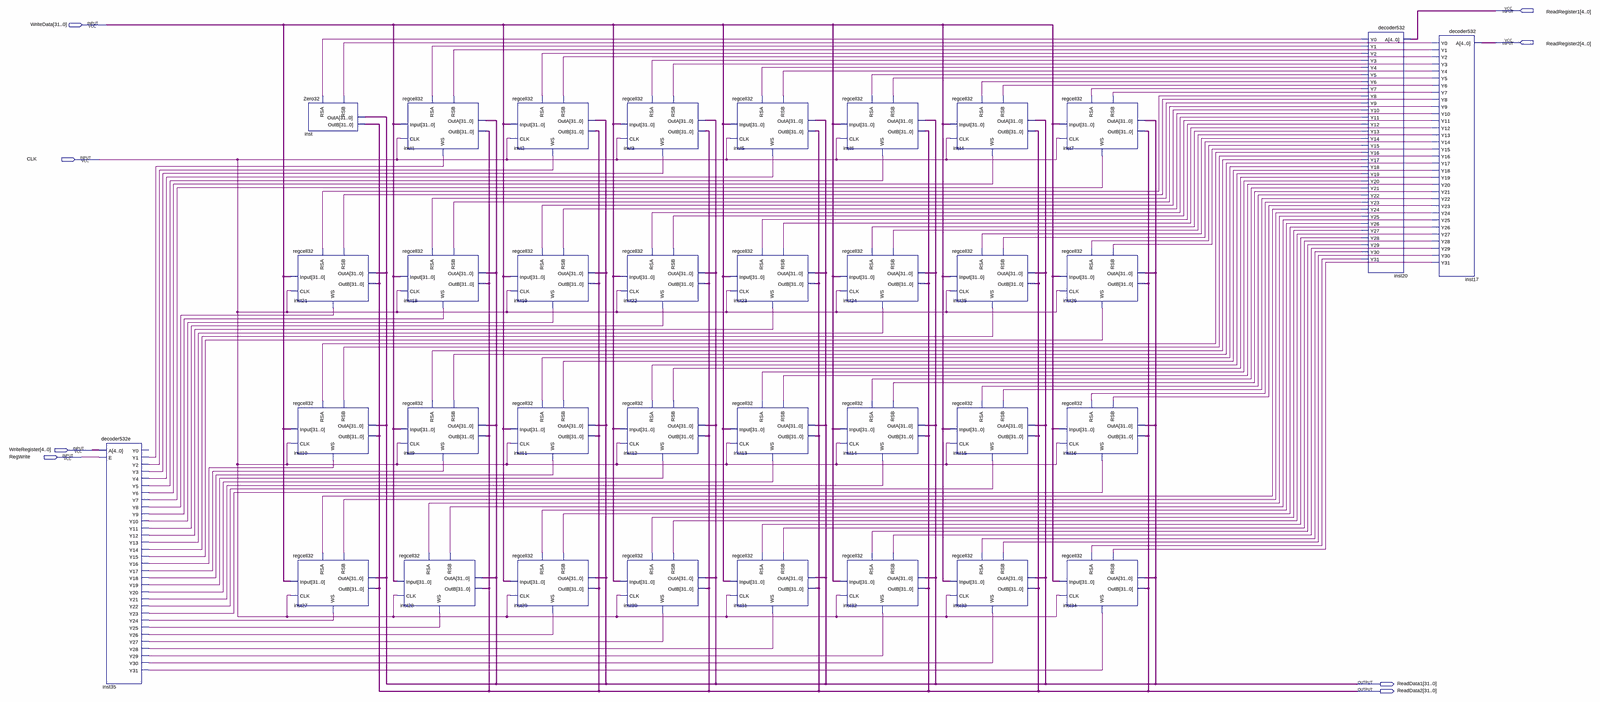
[diagram p0: schematic sheet, whole]
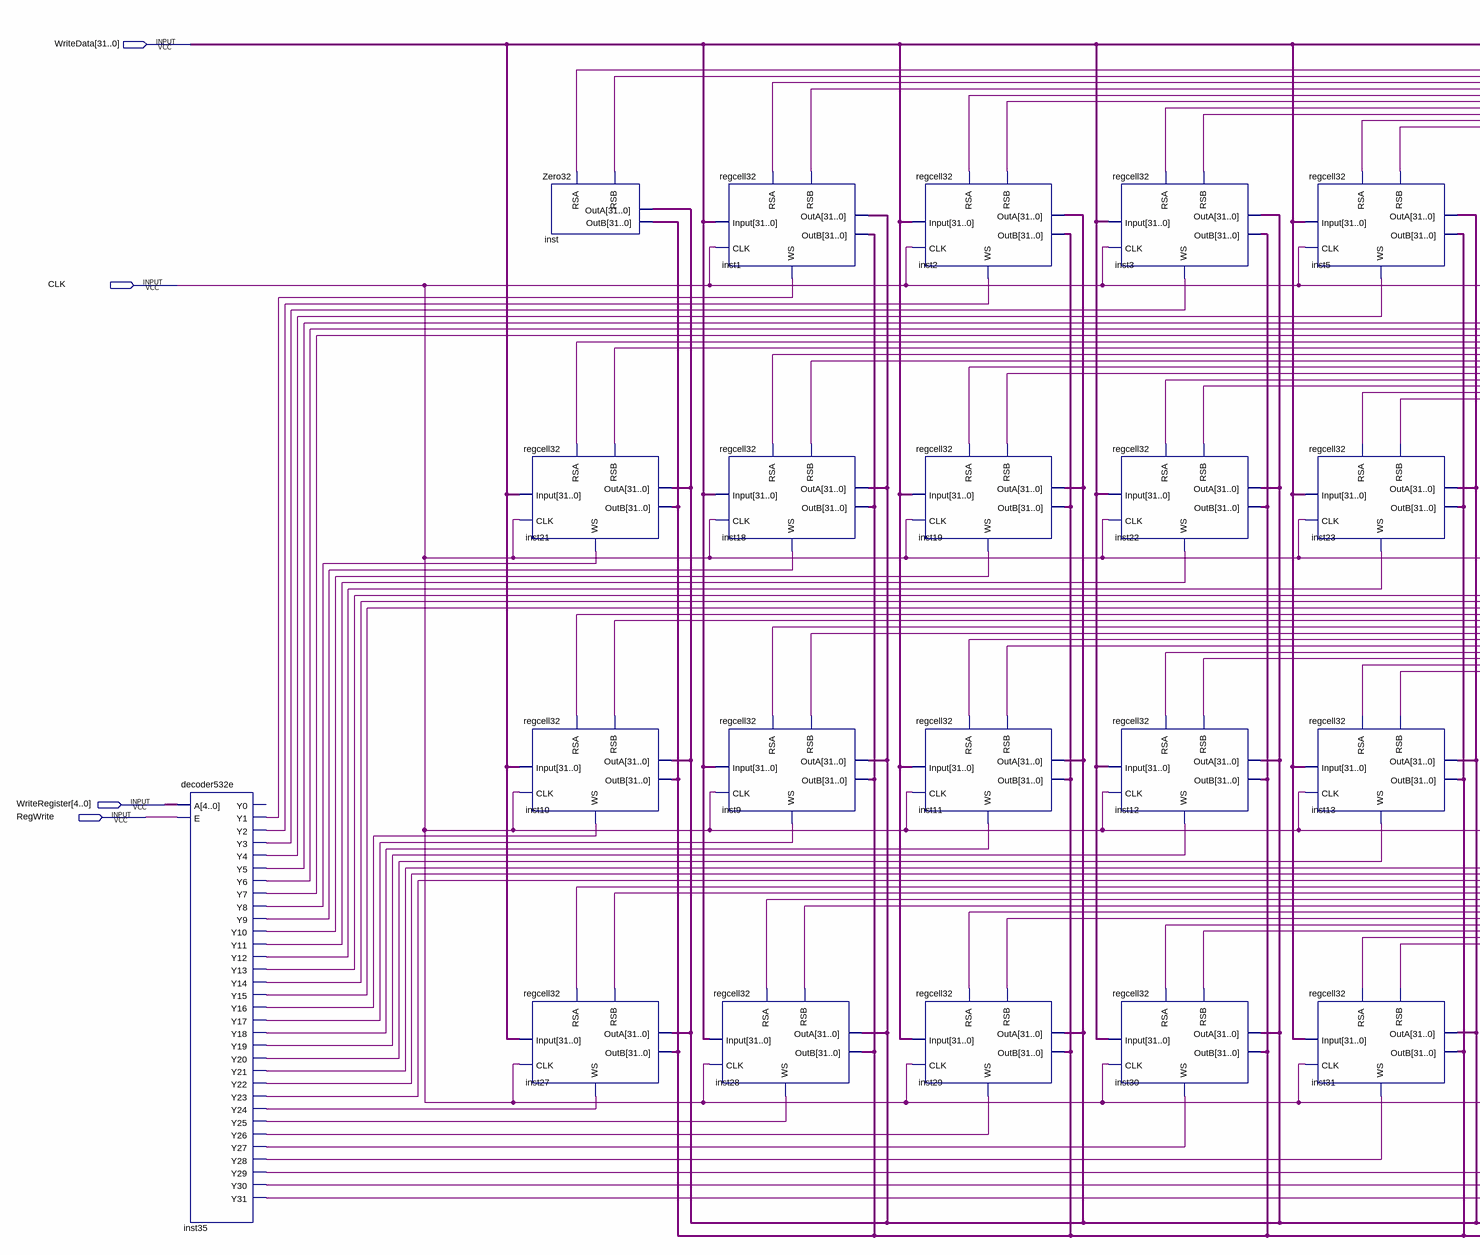
[diagram p1: schematic sheet, left part]
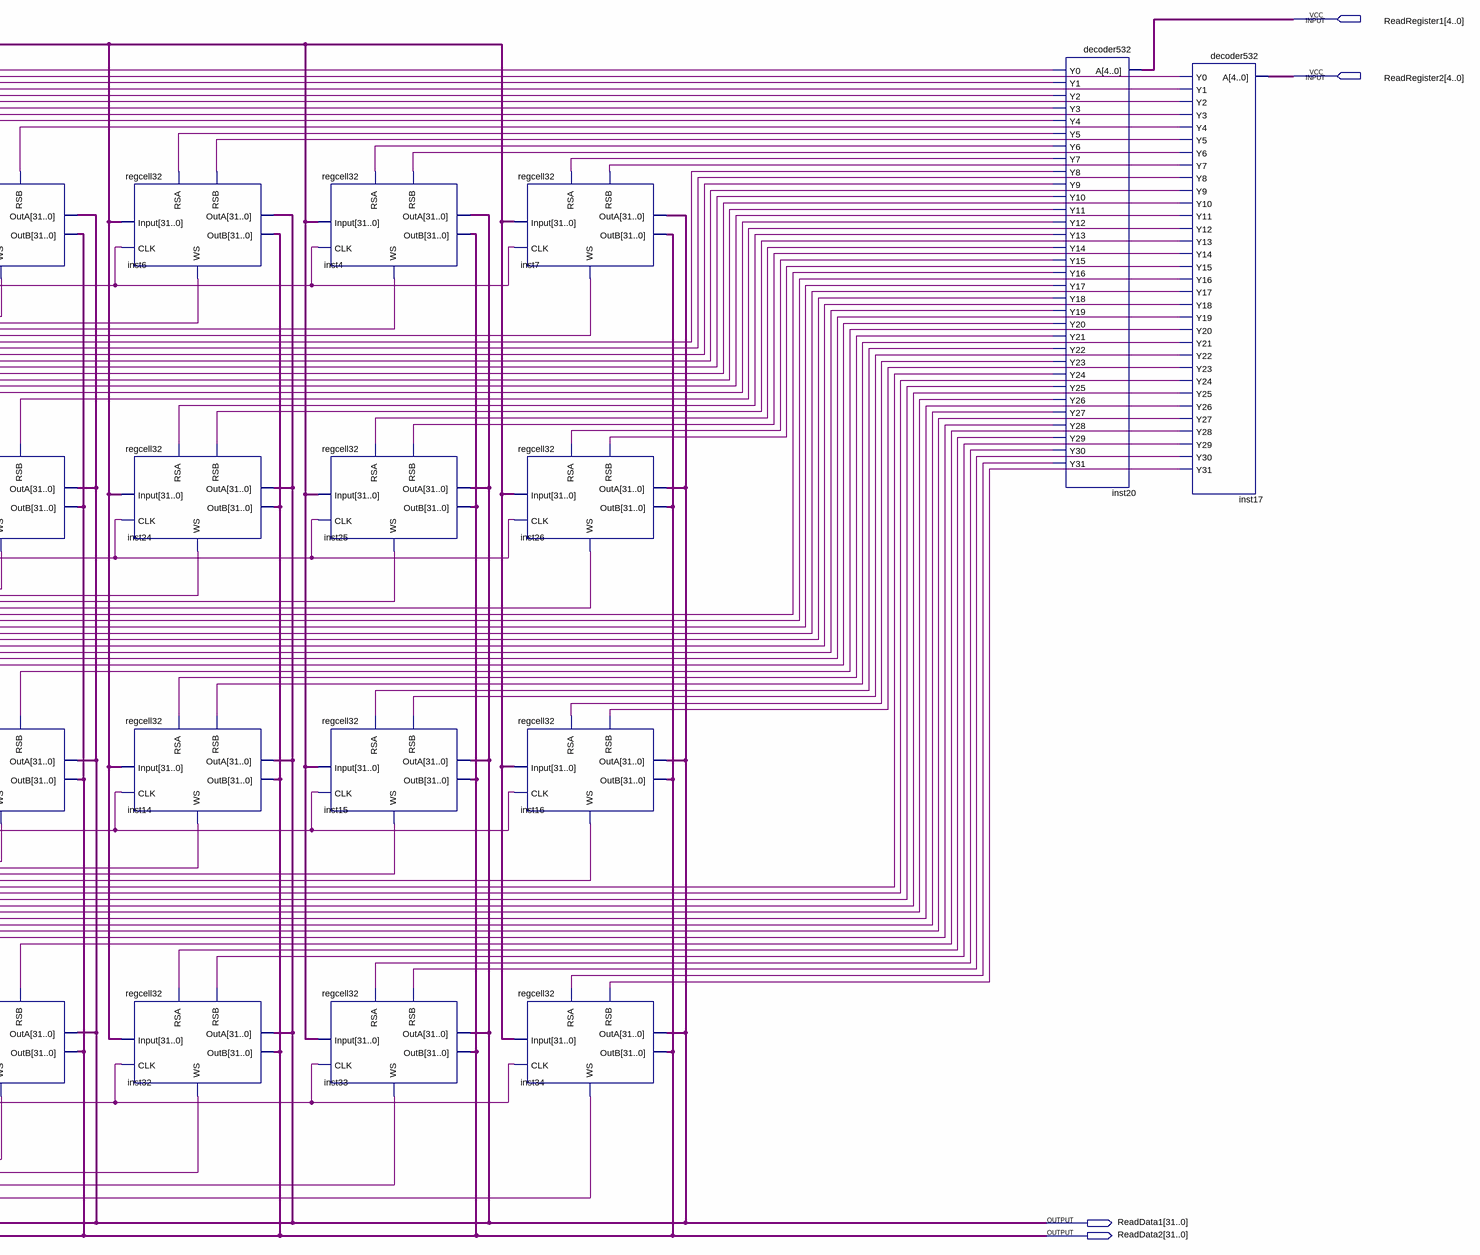
[diagram p2: schematic sheet, right part]
// Quartus schematic Registers.bdf as structural Verilog: 35 symbols, 8 pins
module Registers (
  input  [4:0] ReadRegister1,
  input  [31:0] WriteData,
  input  [4:0] ReadRegister2,
  input  CLK,
  input  [4:0] WriteRegister,
  input  RegWrite,
  output [31:0] ReadData1,
  output [31:0] ReadData2
);

  wire inst17_y0, inst17_y1, inst17_y2, inst17_y3, inst17_y4, inst17_y5, inst17_y6, inst17_y7, inst17_y8,
       inst17_y9, inst17_y10, inst17_y11, inst17_y12, inst17_y13, inst17_y14, inst17_y15, inst17_y16,
       inst17_y17, inst17_y18, inst17_y19, inst17_y20, inst17_y21, inst17_y22, inst17_y23, inst17_y24,
       inst17_y25, inst17_y26, inst17_y27, inst17_y28, inst17_y29, inst17_y30, inst17_y31, inst20_y0,
       inst20_y1, inst20_y2, inst20_y3, inst20_y4, inst20_y5, inst20_y6, inst20_y7, inst20_y8, inst20_y9,
       inst20_y10, inst20_y11, inst20_y12, inst20_y13, inst20_y14, inst20_y15, inst20_y16, inst20_y17,
       inst20_y18, inst20_y19, inst20_y20, inst20_y21, inst20_y22, inst20_y23, inst20_y24, inst20_y25,
       inst20_y26, inst20_y27, inst20_y28, inst20_y29, inst20_y30, inst20_y31, inst35_y1, inst35_y2,
       inst35_y3, inst35_y4, inst35_y5, inst35_y6, inst35_y7, inst35_y8, inst35_y9, inst35_y10, inst35_y11,
       inst35_y12, inst35_y13, inst35_y14, inst35_y15, inst35_y16, inst35_y17, inst35_y18, inst35_y19,
       inst35_y20, inst35_y21, inst35_y22, inst35_y23, inst35_y24, inst35_y25, inst35_y26, inst35_y27,
       inst35_y28, inst35_y29, inst35_y30, inst35_y31;

  decoder532e inst35 (
    .A(WriteRegister), .E(RegWrite), .Y1(inst35_y1), .Y2(inst35_y2), .Y3(inst35_y3), .Y4(inst35_y4),
    .Y5(inst35_y5), .Y6(inst35_y6), .Y7(inst35_y7), .Y8(inst35_y8), .Y9(inst35_y9), .Y10(inst35_y10),
    .Y11(inst35_y11), .Y12(inst35_y12), .Y13(inst35_y13), .Y14(inst35_y14), .Y15(inst35_y15),
    .Y16(inst35_y16), .Y17(inst35_y17), .Y18(inst35_y18), .Y19(inst35_y19), .Y20(inst35_y20),
    .Y21(inst35_y21), .Y22(inst35_y22), .Y23(inst35_y23), .Y24(inst35_y24), .Y25(inst35_y25),
    .Y26(inst35_y26), .Y27(inst35_y27), .Y28(inst35_y28), .Y29(inst35_y29), .Y30(inst35_y30), .Y31(inst35_y31));  // open: Y0
  regcell32 inst21 (
    .Input(WriteData), .CLK(CLK), .RSA(inst20_y8), .RSB(inst17_y8), .WS(inst35_y8), .OutA(ReadData1),
    .OutB(ReadData2));
  regcell32 inst10 (
    .Input(WriteData), .CLK(CLK), .RSA(inst20_y16), .RSB(inst17_y16), .WS(inst35_y16), .OutA(ReadData1),
    .OutB(ReadData2));
  regcell32 inst27 (
    .Input(WriteData), .CLK(CLK), .RSA(inst20_y24), .RSB(inst17_y24), .WS(inst35_y24), .OutA(ReadData1),
    .OutB(ReadData2));
  Zero32 inst (.RSB(inst17_y0), .RSA(inst20_y0), .OutA(ReadData1), .OutB(ReadData2));
  regcell32 inst1 (
    .Input(WriteData), .CLK(CLK), .RSA(inst20_y1), .RSB(inst17_y1), .WS(inst35_y1), .OutA(ReadData1),
    .OutB(ReadData2));
  regcell32 inst18 (
    .Input(WriteData), .CLK(CLK), .RSA(inst20_y9), .RSB(inst17_y9), .WS(inst35_y9), .OutA(ReadData1),
    .OutB(ReadData2));
  regcell32 inst9 (
    .Input(WriteData), .CLK(CLK), .RSA(inst20_y17), .RSB(inst17_y17), .WS(inst35_y17), .OutA(ReadData1),
    .OutB(ReadData2));
  regcell32 inst28 (
    .Input(WriteData), .CLK(CLK), .RSA(inst20_y25), .RSB(inst17_y25), .WS(inst35_y25), .OutA(ReadData1),
    .OutB(ReadData2));
  regcell32 inst2 (
    .Input(WriteData), .CLK(CLK), .RSA(inst20_y2), .RSB(inst17_y2), .WS(inst35_y2), .OutA(ReadData1),
    .OutB(ReadData2));
  regcell32 inst19 (
    .Input(WriteData), .CLK(CLK), .RSA(inst20_y10), .RSB(inst17_y10), .WS(inst35_y10), .OutA(ReadData1),
    .OutB(ReadData2));
  regcell32 inst11 (
    .Input(WriteData), .CLK(CLK), .RSA(inst20_y18), .RSB(inst17_y18), .WS(inst35_y18), .OutA(ReadData1),
    .OutB(ReadData2));
  regcell32 inst29 (
    .Input(WriteData), .CLK(CLK), .RSA(inst20_y26), .RSB(inst17_y26), .WS(inst35_y26), .OutA(ReadData1),
    .OutB(ReadData2));
  regcell32 inst3 (
    .Input(WriteData), .CLK(CLK), .RSA(inst20_y3), .RSB(inst17_y3), .WS(inst35_y3), .OutA(ReadData1),
    .OutB(ReadData2));
  regcell32 inst22 (
    .Input(WriteData), .CLK(CLK), .RSA(inst20_y11), .RSB(inst17_y11), .WS(inst35_y11), .OutA(ReadData1),
    .OutB(ReadData2));
  regcell32 inst12 (
    .Input(WriteData), .CLK(CLK), .RSA(inst20_y19), .RSB(inst17_y19), .WS(inst35_y19), .OutA(ReadData1),
    .OutB(ReadData2));
  regcell32 inst30 (
    .Input(WriteData), .CLK(CLK), .RSA(inst20_y27), .RSB(inst17_y27), .WS(inst35_y27), .OutA(ReadData1),
    .OutB(ReadData2));
  regcell32 inst5 (
    .Input(WriteData), .CLK(CLK), .RSA(inst20_y4), .RSB(inst17_y4), .WS(inst35_y4), .OutA(ReadData1),
    .OutB(ReadData2));
  regcell32 inst23 (
    .Input(WriteData), .CLK(CLK), .RSA(inst20_y12), .RSB(inst17_y12), .WS(inst35_y12), .OutA(ReadData1),
    .OutB(ReadData2));
  regcell32 inst13 (
    .Input(WriteData), .CLK(CLK), .RSA(inst20_y20), .RSB(inst17_y20), .WS(inst35_y20), .OutA(ReadData1),
    .OutB(ReadData2));
  regcell32 inst31 (
    .Input(WriteData), .CLK(CLK), .RSA(inst20_y28), .RSB(inst17_y28), .WS(inst35_y28), .OutA(ReadData1),
    .OutB(ReadData2));
  regcell32 inst6 (
    .Input(WriteData), .CLK(CLK), .RSA(inst20_y5), .RSB(inst17_y5), .WS(inst35_y5), .OutA(ReadData1),
    .OutB(ReadData2));
  regcell32 inst24 (
    .Input(WriteData), .CLK(CLK), .RSA(inst20_y13), .RSB(inst17_y13), .WS(inst35_y13), .OutA(ReadData1),
    .OutB(ReadData2));
  regcell32 inst14 (
    .Input(WriteData), .CLK(CLK), .RSA(inst20_y21), .RSB(inst17_y21), .WS(inst35_y21), .OutA(ReadData1),
    .OutB(ReadData2));
  regcell32 inst32 (
    .Input(WriteData), .CLK(CLK), .RSA(inst20_y29), .RSB(inst17_y29), .WS(inst35_y29), .OutA(ReadData1),
    .OutB(ReadData2));
  regcell32 inst4 (
    .Input(WriteData), .CLK(CLK), .RSA(inst20_y6), .RSB(inst17_y6), .WS(inst35_y6), .OutA(ReadData1),
    .OutB(ReadData2));
  regcell32 inst25 (
    .Input(WriteData), .CLK(CLK), .RSA(inst20_y14), .RSB(inst17_y14), .WS(inst35_y14), .OutA(ReadData1),
    .OutB(ReadData2));
  regcell32 inst15 (
    .Input(WriteData), .CLK(CLK), .RSA(inst20_y22), .RSB(inst17_y22), .WS(inst35_y22), .OutA(ReadData1),
    .OutB(ReadData2));
  regcell32 inst33 (
    .Input(WriteData), .CLK(CLK), .RSA(inst20_y30), .RSB(inst17_y30), .WS(inst35_y30), .OutA(ReadData1),
    .OutB(ReadData2));
  regcell32 inst7 (
    .Input(WriteData), .CLK(CLK), .RSA(inst20_y7), .RSB(inst17_y7), .WS(inst35_y7), .OutA(ReadData1),
    .OutB(ReadData2));
  regcell32 inst26 (
    .Input(WriteData), .CLK(CLK), .RSA(inst20_y15), .RSB(inst17_y15), .WS(inst35_y15), .OutA(ReadData1),
    .OutB(ReadData2));
  regcell32 inst16 (
    .Input(WriteData), .CLK(CLK), .RSA(inst20_y23), .RSB(inst17_y23), .WS(inst35_y23), .OutA(ReadData1),
    .OutB(ReadData2));
  regcell32 inst34 (
    .Input(WriteData), .CLK(CLK), .RSA(inst20_y31), .RSB(inst17_y31), .WS(inst35_y31), .OutA(ReadData1),
    .OutB(ReadData2));
  decoder532 inst20 (
    .A(ReadRegister1), .Y0(inst20_y0), .Y1(inst20_y1), .Y2(inst20_y2), .Y3(inst20_y3), .Y4(inst20_y4),
    .Y5(inst20_y5), .Y6(inst20_y6), .Y7(inst20_y7), .Y8(inst20_y8), .Y9(inst20_y9), .Y10(inst20_y10),
    .Y11(inst20_y11), .Y12(inst20_y12), .Y13(inst20_y13), .Y14(inst20_y14), .Y15(inst20_y15),
    .Y16(inst20_y16), .Y17(inst20_y17), .Y18(inst20_y18), .Y19(inst20_y19), .Y20(inst20_y20),
    .Y21(inst20_y21), .Y22(inst20_y22), .Y23(inst20_y23), .Y24(inst20_y24), .Y25(inst20_y25),
    .Y26(inst20_y26), .Y27(inst20_y27), .Y28(inst20_y28), .Y29(inst20_y29), .Y30(inst20_y30), .Y31(inst20_y31));
  decoder532 inst17 (
    .A(ReadRegister2), .Y0(inst17_y0), .Y1(inst17_y1), .Y2(inst17_y2), .Y3(inst17_y3), .Y4(inst17_y4),
    .Y5(inst17_y5), .Y6(inst17_y6), .Y7(inst17_y7), .Y8(inst17_y8), .Y9(inst17_y9), .Y10(inst17_y10),
    .Y11(inst17_y11), .Y12(inst17_y12), .Y13(inst17_y13), .Y14(inst17_y14), .Y15(inst17_y15),
    .Y16(inst17_y16), .Y17(inst17_y17), .Y18(inst17_y18), .Y19(inst17_y19), .Y20(inst17_y20),
    .Y21(inst17_y21), .Y22(inst17_y22), .Y23(inst17_y23), .Y24(inst17_y24), .Y25(inst17_y25),
    .Y26(inst17_y26), .Y27(inst17_y27), .Y28(inst17_y28), .Y29(inst17_y29), .Y30(inst17_y30), .Y31(inst17_y31));
endmodule
